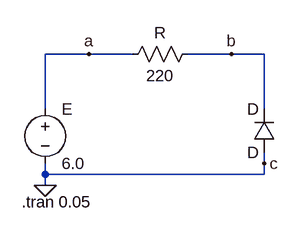
[diagram p0: schematic Draft5.asc]
Draft5.asc, the LTspice schematic file:
Version 4
SHEET 1 880 680
WIRE 144 64 80 64
WIRE 208 64 144 64
WIRE 352 64 288 64
WIRE 400 64 352 64
WIRE 80 144 80 64
WIRE 400 144 400 64
WIRE 400 224 400 208
WIRE 80 240 80 224
WIRE 400 240 400 224
WIRE 400 240 80 240
WIRE 80 256 80 240
FLAG 80 256 0
FLAG 144 64 a
FLAG 352 64 b
FLAG 400 224 c
SYMBOL voltage 80 128 R0
WINDOW 123 0 0 Left 0
WINDOW 39 0 0 Left 0
SYMATTR InstName E
SYMATTR Value 6.0
SYMBOL res 304 48 R90
WINDOW 0 0 56 VBottom 2
WINDOW 3 32 56 VTop 2
SYMATTR InstName R
SYMATTR Value 220
SYMATTR SpiceLine tol=1 pwr=0.1
SYMBOL diode 416 208 R180
WINDOW 0 24 64 Left 2
WINDOW 3 24 0 Left 2
SYMATTR InstName D
TEXT 46 280 Left 2 !.tran 0.05

The netlist it stands for:
* Draft5.asc
V§E a 0 6.0
R b a 220 tol=1 pwr=0.1
D 0 b D
.model D D
.lib standard.dio
.tran 0.05
.backanno
.end